# EAGLE design squawkbox_m_0.1 (EAGLE 7.6.0)
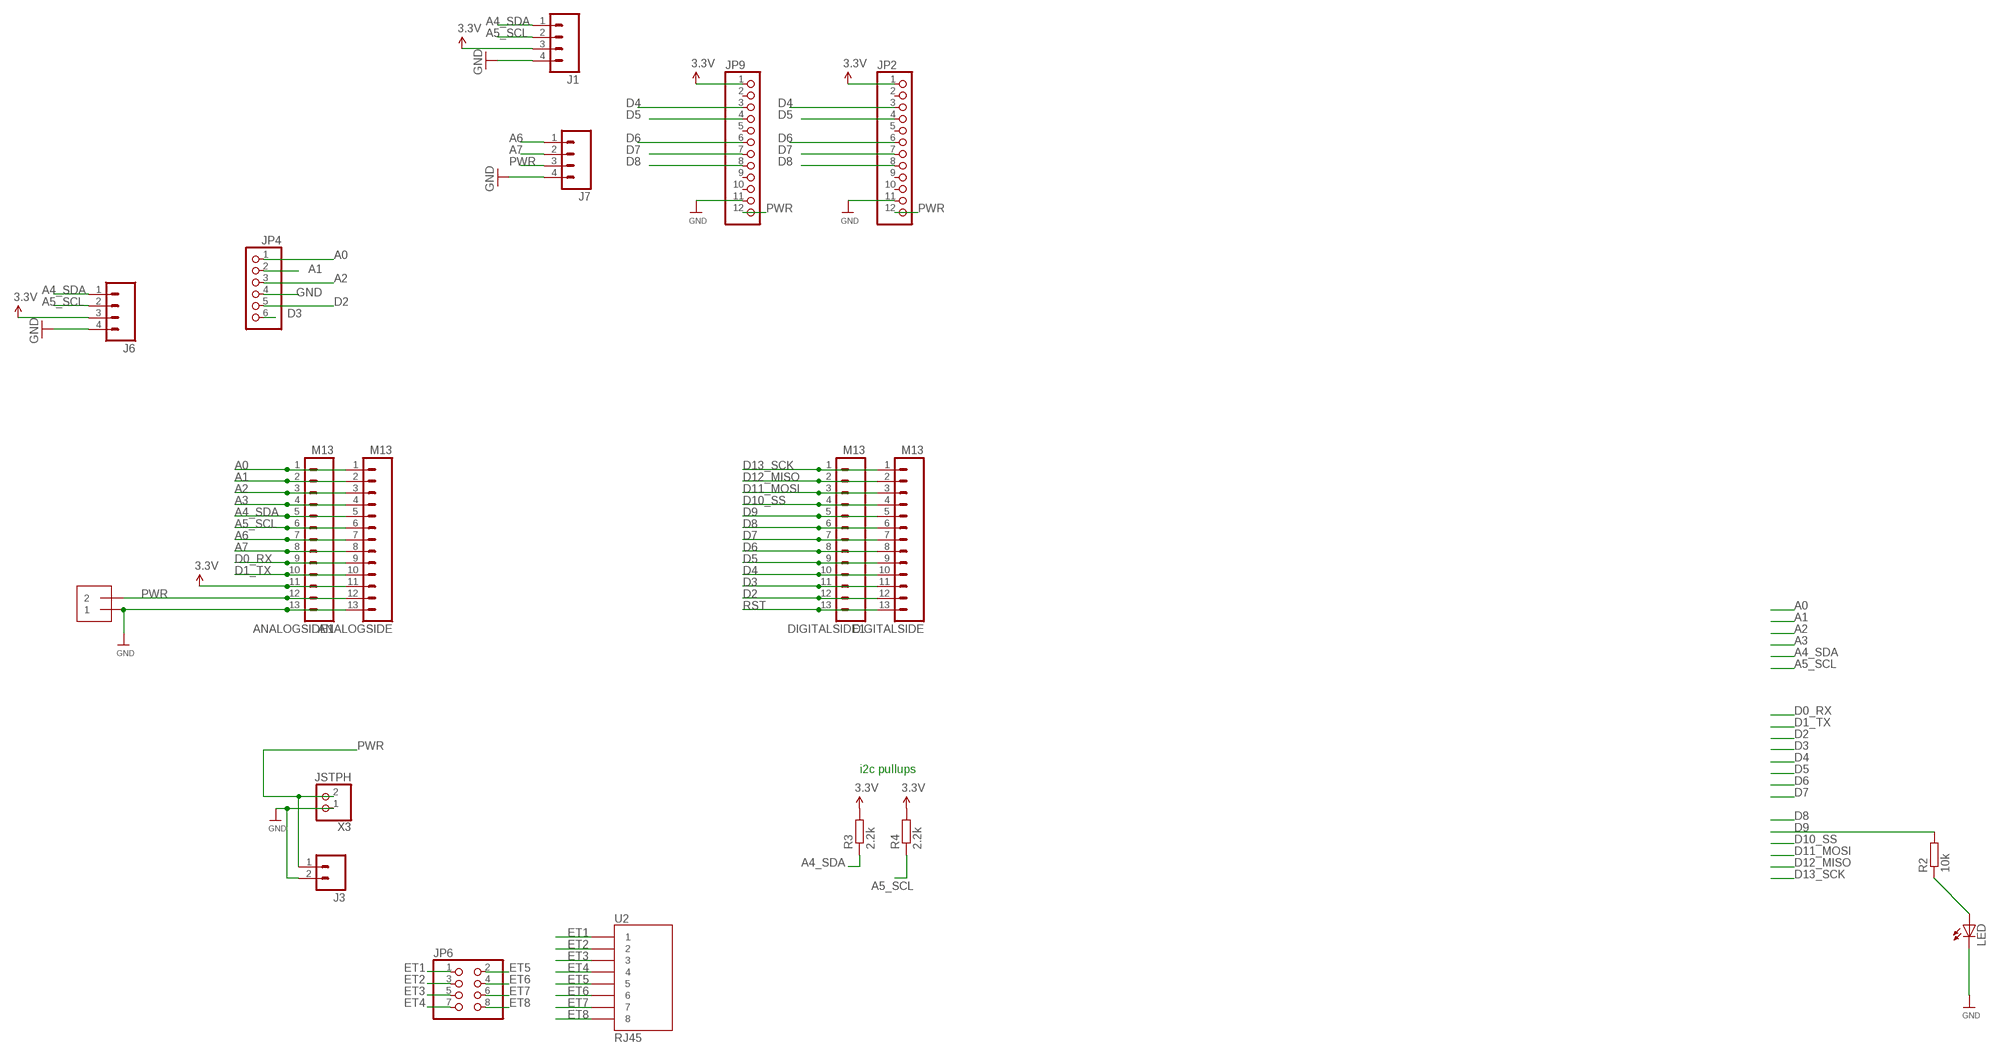
[diagram p0: schematic, sheet 1]

## Parts
ANALOGSIDE  M13  [1X13]
ANALOGSIDE1  M13  [1X13]
DIGITALSIDE  M13  [1X13]
DIGITALSIDE1  M13  [1X13]
J1  M04PTH  [1X04]
J2  1X2-3.5MM  [1X2-3.5MM]
J3  M02PTH  [1X02]
J6  M04SCREW  [SCREWTERMINAL-3.5MM-4]
J7  M04SCREW  [SCREWTERMINAL-3.5MM-4]
JP2  PINHD-1X12-CB  [1X12-CB]
JP4  PINHD-1X6-3.5MM  [1X06-3.5MM]
JP6  PINHD-2X4  [2X04]
JP9  PINHD-1X12-CB  [1X12-CB]
LED  LED3MM  [LED3MM]
R2  10k  R-EU_0204/7  [0204/7]
R3  2.2k  R-EU_0204/7  [0204/7]
R4  2.2k  R-EU_0204/7  [0204/7]
U2  RJ45  RJ45-8PTH  [RJ45-8]
X3  JSTPH  CON_JST_PH_2PIN  [JSTPH2]

## Nets
A0: ANALOGSIDE1.1 ANALOGSIDE.1 JP4.1
A1: ANALOGSIDE1.2 ANALOGSIDE.2 JP4.2
A2: ANALOGSIDE1.3 ANALOGSIDE.3 JP4.3
A3: ANALOGSIDE1.4 ANALOGSIDE.4
A4_SDA: ANALOGSIDE1.5 ANALOGSIDE.5 J1.1 J6.1 R3.1
A5_SCL: ANALOGSIDE1.6 ANALOGSIDE.6 J1.2 J6.2 R4.1
A6: ANALOGSIDE1.7 ANALOGSIDE.7 J7.1
A7: ANALOGSIDE1.8 ANALOGSIDE.8 J7.2
D0_RX: ANALOGSIDE1.9 ANALOGSIDE.9
D1_TX: ANALOGSIDE1.10 ANALOGSIDE.10
D2: DIGITALSIDE1.12 DIGITALSIDE.12 JP4.5
D3: DIGITALSIDE1.11 DIGITALSIDE.11 JP4.6
D4: DIGITALSIDE1.10 DIGITALSIDE.10 JP2.3 JP9.3
D5: DIGITALSIDE1.9 DIGITALSIDE.9 JP2.4 JP9.4
D6: DIGITALSIDE1.8 DIGITALSIDE.8 JP2.6 JP9.6
D7: DIGITALSIDE1.7 DIGITALSIDE.7 JP2.7 JP9.7
D8: DIGITALSIDE1.6 DIGITALSIDE.6 JP2.8 JP9.8
D9: DIGITALSIDE1.5 DIGITALSIDE.5 R2.2
D10_SS: DIGITALSIDE1.4 DIGITALSIDE.4
D11_MOSI: DIGITALSIDE1.3 DIGITALSIDE.3
D12_MISO: DIGITALSIDE1.2 DIGITALSIDE.2
D13_SCK: DIGITALSIDE1.1 DIGITALSIDE.1
ET1: JP6.1 U2.1
ET2: JP6.3 U2.2
ET3: JP6.5 U2.3
ET4: JP6.7 U2.4
ET5: JP6.2 U2.5
ET6: JP6.4 U2.6
ET7: JP6.6 U2.7
ET8: JP6.8 U2.8
GND [power]: ANALOGSIDE1.13 ANALOGSIDE.13 J1.4 J2.1 J3.2 J6.4 J7.4 JP2.11 JP4.4 JP9.11 LED.K(C) X3.1
N$2: LED.A R2.1
PWR [power]: ANALOGSIDE1.12 ANALOGSIDE.12 J2.2 J3.1 J7.3 JP2.12 JP9.12 X3.2
RST: DIGITALSIDE1.13 DIGITALSIDE.13
SPEAKER2+: JP2.10
SPEAKER2+1: JP9.10
VCC [power]: ANALOGSIDE1.11 ANALOGSIDE.11 J1.3 J6.3 JP2.1 JP9.1 R3.2 R4.2 ; supply symbol labelled 3.3V
Unconnected: JP2.2 JP2.5 JP2.9 JP9.2 JP9.5 JP9.9

## Notes on the sheet
- i2c pullups

## Library data of the parts
ANALOGSIDE ANALOGSIDE1 DIGITALSIDE DIGITALSIDE1 = SparkFun-Connectors:M13: 13-pin single row .1" header
J1 = SparkFun-Connectors:M04: Header 4 Standard 4-pin 0.1" header. Use with straight break away headers (SKU : PRT-00116), right angle break away headers (PRT-00553), swiss pins (PRT-00743), machine pins (PRT-00117), and female headers (PRT-00115). Molex polarized connector foot print use with SKU : PRT-08231 with associated crimp pins and housings. 1MM SMD Version SKU: PRT-10208; PROD_ID: CONN-09696
J2 = adafruit:1X2: 3.5mm Terminal block http://www.ladyada.net/library/pcb/eaglelibrary.html
J3 = SparkFun-Connectors:M02: Standard 2-pin 0.1" header. Use with - straight break away headers ( PRT-00116) - right angle break away headers (PRT-00553) - swiss pins (PRT-00743) - machine pins (PRT-00117) - female headers (PRT-00115) Molex polarized connector foot print use with: PRT-08233 with associated crimp pins and housings. 2.54_SCREWTERM for use with PRT-10571. 3.5mm Screw Terminal footprints for PRT-08084 5mm Screw Terminal footprints for use with PRT-08432
J6 J7 = SparkFun-Connectors:M04: Header 4 Standard 4-pin 0.1" header. Use with straight break away headers (SKU : PRT-00116), right angle break away headers (PRT-00553), swiss pins (PRT-00743), machine pins (PRT-00117), and female headers (PRT-00115). Molex polarized connector foot print use with SKU : PRT-08231 with associated crimp pins and housings. 1MM SMD Version SKU: PRT-10208; PROD_ID: Combine 2x8399
JP2 JP9 = adafruit2:PINHD-1X12: PIN HEADER
JP4 = adafruit:PINHD-1X6: PIN HEADER
JP6 = pinhead:PINHD-2X4: PIN HEADER
LED = led:LED: LED OSRAM: - CHIPLED LG R971, LG N971, LY N971, LG Q971, LY Q971, LO R971, LY R971 LH N974, LH R974 LS Q976, LO Q976, LY Q976 LO Q996 - Hyper CHIPLED LW Q18S LB Q993, LB Q99A, LB R99A - SideLED LS A670, LO A670, LY A670, LG A670, LP A670 LB A673, LV A673, LT A673, LW A673 LH A674 LY A675 LS A676, LA A676, LO A676, LY A676, LW A676 LS A679, LY A679, LG A679 - Hyper Micro SIDELED® LS Y876, LA Y876, LO Y876, LY Y876 LT Y87S - SmartLED LW L88C, LW L88S LB L89C, LB L89S, LG L890 LS L89K, LO L89K, LY L89K LS L896, LA L896, LO L896, LY L896 - TOPLED LS T670, LO T670, LY T670, LG T670, LP T670 LSG T670, LSP T670, LSY T670, LOP T670, LYG T670 LG T671, LOG T671, LSG T671 LB T673, LV T673, LT T673, LW T673 LH T674 LS T676, LA T676, LO T676, LY T676, LB T676, LH T676, LSB T676, LW T676 LB T67C, LV T67C, LT T67C, LS T67K, LO T67K, LY T67K, LW E67C LS E67B, LA E67B, LO E67B, LY E67B, LB E67C, LV E67C, LT E67C LW T67C LS T679, LY T679, LG T679 LS T770, LO T770, LY T770, LG T770, LP T770 LB T773, LV T773, LT T773, LW T773 LH T774 LS E675, LA E675, LY E675, LS T675 LS T776, LA T776, LO T776, LY T776, LB T776 LHGB T686 LT T68C, LB T68C - Hyper Mini TOPLED® LB M676 - Mini TOPLED Santana® LG M470 LS M47K, LO M47K, LY M47K Source: http://www.osram.convergy.de LUXEON: - LUMILED® LXK2-PW12-R00, LXK2-PW12-S00, LXK2-PW14-U00, LXK2-PW14-V00 LXK2-PM12-R00, LXK2-PM12-S00, LXK2-PM14-U00 LXK2-PE12-Q00, LXK2-PE12-R00, LXK2-PE12-S00, LXK2-PE14-T00, LXK2-PE14-U00 LXK2-PB12-K00, LXK2-PB12-L00, LXK2-PB12-M00, LXK2-PB14-N00, LXK2-PB14-P00, LXK2-PB14-Q00 LXK2-PR12-L00, LXK2-PR12-M00, LXK2-PR14-Q00, LXK2-PR14-R00 LXK2-PD12-Q00, LXK2-PD12-R00, LXK2-PD12-S00 LXK2-PH12-R00, LXK2-PH12-S00 LXK2-PL12-P00, LXK2-PL12-Q00, LXK2-PL12-R00 Source: www.luxeon.com KINGBRIGHT: KA-3528ASYC Source: www.kingbright.com
R2-R4 = resistor:R-EU_: RESISTOR, European symbol
U2 = SparkFun:RJ45-8: RJ45 Jack Simple RJ45, 8-pin connection - connector for common Cat5, Cat5e, and Cat6 Ethernet cables. Footprint not yet proven in production. Connector sku is PRT-00643; Breakout PCB sku is BOB-00716.
X3 = microbuilder:CON_JST_PH_2PIN: JST 2-Pin Right-Angle Connector PH-Series - 4UConnector: 17311 SH-Series - 4UConnector: 07278

## Net classes
1 power: width 0.381 mm, clearance 0.254 mm

## Board
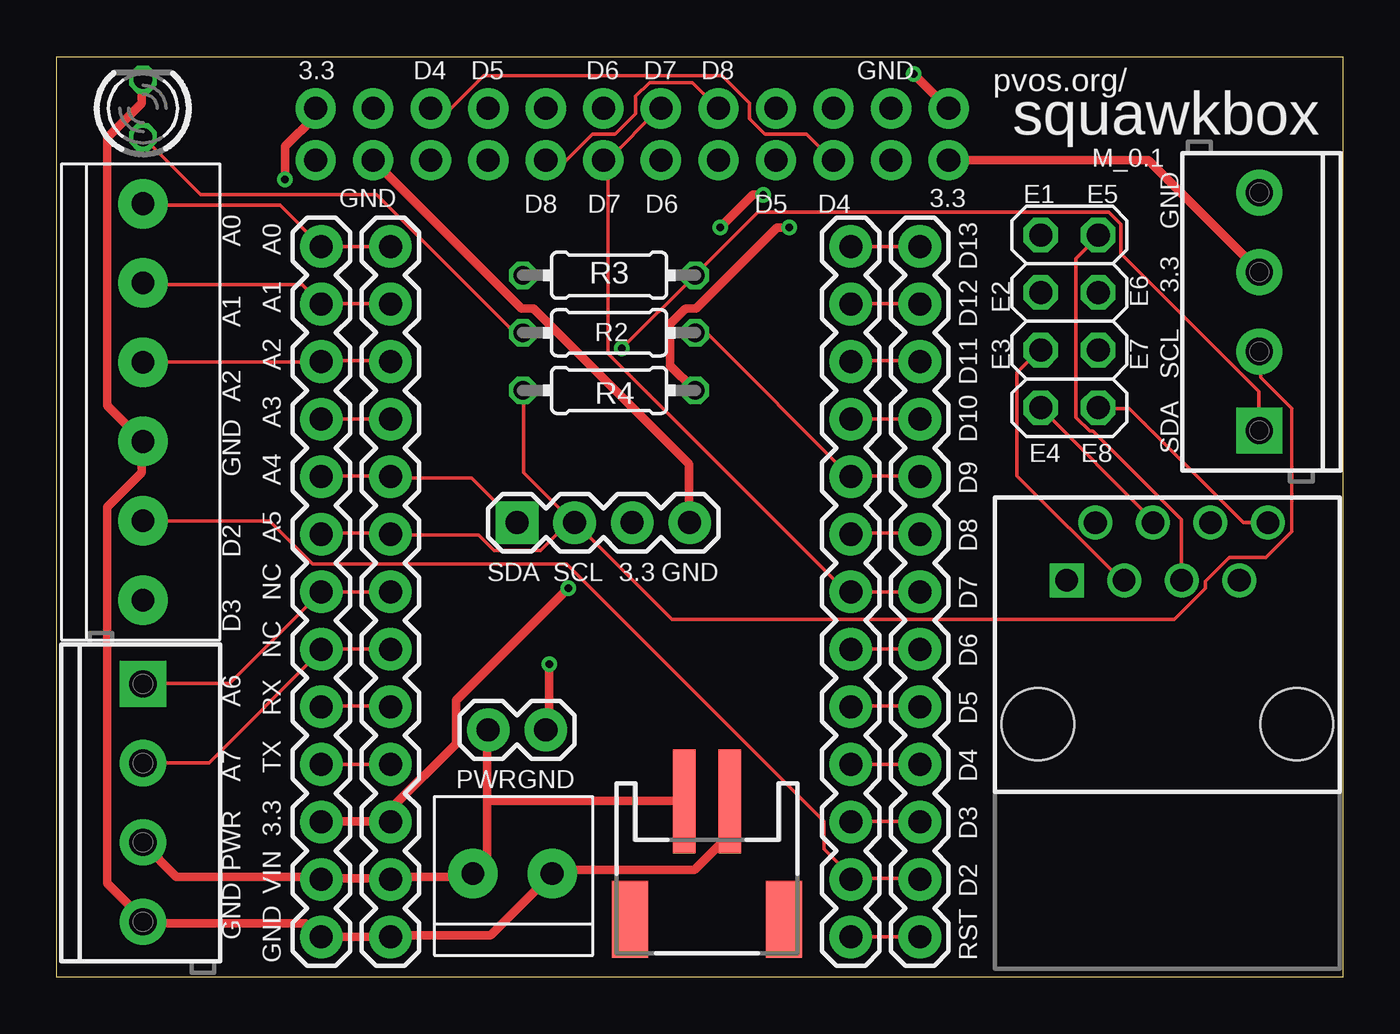
[diagram p1: board, top side]
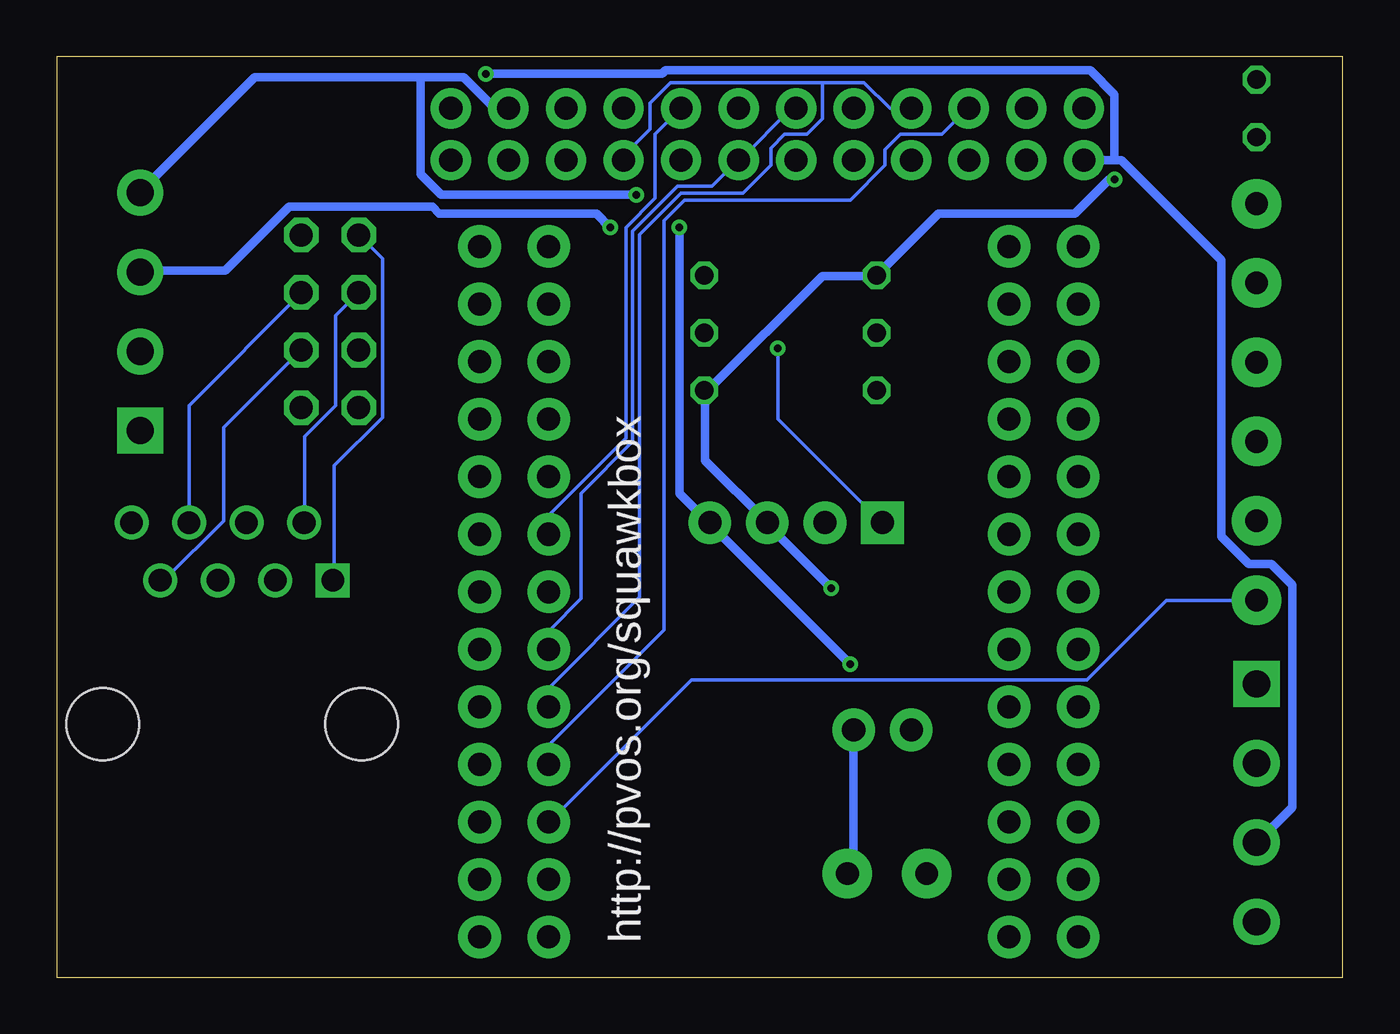
[diagram p2: board, bottom side, seen from below]

Size 56.77 x 40.64 mm. Coordinates in mm from the lower left corner, seen from the top.
Outline: 0,40.64 56.77,40.64 56.77,0 0,0 0,40.64
Copper layers (1*16): Top 0.0356mm / dielectric 1.5011mm / Bottom 0.0356mm
Design rules "oshpark-2layer": minimum track width 6mil, minimum drill 13mil, track to track 6mil, track to pad 6mil, pad to pad 6mil, via to via 6mil, smd to smd 6mil, copper to edge 15mil, drill to drill 6mil, minimum pad ring 7mil, minimum via ring 7mil, stop-mask expansion 2.5mil, vias tented up to drill 0mil, thermal gap 10mil

### Footprints (pad centres in the part's own frame; a part is rotated, then mirrored left to right if it is on the bottom)
1X13 = drill 1.016 pad 1.88: 1 0,0; 2 2.54,0; 3 5.08,0; 4 7.62,0; 5 10.16,0; 6 12.7,0; 7 15.24,0; 8 17.78,0; 9 20.32,0; 10 22.86,0; 11 25.4,0; 12 27.94,0; 13 30.48,0
1X04 = drill 1.016 pad 1.88 square: 1 0,0 | drill 1.016 pad 1.88: 2 2.54,0; 3 5.08,0; 4 7.62,0
1X2-3.5MM = drill 1 pad 2.184: 1 1.8,0; 2 -1.7,0
1X02 = drill 1.016 pad 1.88: 1 0,0; 2 2.54,0
SCREWTERMINAL-3.5MM-4 = drill 1.2 pad 2.032 square: 1 0,0 | drill 1.2 pad 2.032: 2 3.5,0; 3 7,0; 4 10.5,0
1X12-CB = drill 1.016 pad 1.778: 1 -13.97,0; 2 -11.43,0; 3 -8.89,0; 4 -6.35,0; 5 -3.81,0; 6 -1.27,0; 7 1.27,0; 8 3.81,0; 9 6.35,0; 10 8.89,0; 11 11.43,0; 12 13.97,0
1X06-3.5MM = drill 1 pad 2.184: 1 -8.75,0; 2 -5.25,0; 3 -1.75,0; 4 1.75,0; 5 5.25,0; 6 8.75,0
2X04 = drill 1.016 octagon: 1 -3.81,-1.27; 2 -3.81,1.27; 3 -1.27,-1.27; 4 -1.27,1.27; 5 1.27,-1.27; 6 1.27,1.27; 7 3.81,-1.27; 8 3.81,1.27
LED3MM = drill 0.813 octagon: A -1.27,0; K 1.27,0
0204/7 = drill 0.813 octagon: 1 -3.81,0; 2 3.81,0
RJ45-8 = drill 1 square: 1 -4.445,6.35 | drill 1: 2 -3.175,8.89; 3 -1.905,6.35; 4 -0.635,8.89; 5 0.635,6.35; 6 1.905,8.89; 7 3.175,6.35; 8 4.445,8.89 | hole 3.2: -5.715,0; 5.715,0
JSTPH2 = smd 1 x 4.6: 1 -1,-3.7; 2 1,-3.7 | smd 1.6 x 3.4: NC1 -3.4,1.5; NC2 3.4,1.5

### Placement (x,y rotation side)
ANALOGSIDE  14.73,32.26 270 top
ANALOGSIDE1  11.68,32.26 270 top
DIGITALSIDE  35.05,32.26 270 top
DIGITALSIDE1  38.1,32.26 270 top
J1  20.32,20.07 0 top
J2  20.07,4.57 0 top
J3  19.05,10.92 0 top
J6  53.09,24.13 90 top
J7  3.81,12.95 270 top
JP2  25.4,36.07 180 top
JP4  3.81,25.4 270 top
JP6  44.7,28.96 270 top
JP9  25.4,38.35 0 top
LED  3.81,38.35 90 top
R2  24.38,28.45 0 top
R3  24.38,30.99 180 top
R4  24.38,25.91 0 top
U2  49.02,11.18 0 top
X3  28.7,4.06 180 top

### Tracks (layer width: path | path; a pad name or v marks a point on that pad's centre or on a via)
A0
  Top 0.152: ANALOGSIDE.1 ANALOGSIDE1.1 9.86,34.09 3.83,34.09 JP4.1
A1
  Top 0.152: 11.68,29.74 14.73,29.74 ANALOGSIDE.2 | 11.68,29.74 10.85,30.58 3.83,30.58 JP4.2 | 11.68,29.74 ANALOGSIDE1.2
A2
  Top 0.152: ANALOGSIDE.3 14.73,27.23 11.68,27.23 ANALOGSIDE1.3 11.68,27.15 3.83,27.15 JP4.3
A3
  Top 0.152: ANALOGSIDE.4 ANALOGSIDE1.4
A4_SDA  (via drill 0.33)
  Top 0.152: ANALOGSIDE1.5 11.68,22.12 14.73,22.12 ANALOGSIDE.5 14.73,22.05 18.31,22.05 20.3,20.07 J1.1 | v24.94,27.76 28.14,30.96 R3.1 28.22,31.04 30.96,33.78 46.43,33.78 46.96,33.25 46.96,31.95 53.06,25.86 53.06,24.18 J6.1
  Bottom 0.152: v24.94,27.76 24.94,24.64 20.37,20.07 J1.1
A5_SCL
  Top 0.152: ANALOGSIDE1.6 11.68,19.61 14.73,19.61 ANALOGSIDE.6 14.73,19.53 18.62,19.53 19.3,18.85 21.36,18.85 22.66,20.14 J1.2 | R4.1 20.6,25.86 20.6,22.28 22.81,20.07 J1.2 | J6.2 53.14,27.61 53.14,26.47 54.51,25.1 54.51,19.69 53.36,18.54 51.77,18.54 50.7,17.48 50.7,17.17 49.33,15.8 27.15,15.8 22.89,20.07 J1.2
A6
  Top 0.152: ANALOGSIDE.7 ANALOGSIDE1.7 7.65,12.98 3.83,12.98 J7.1
A7
  Top 0.152: ANALOGSIDE.8 14.73,14.5 11.68,14.5 ANALOGSIDE1.8 11.68,14.43 6.73,9.47 3.83,9.47 J7.2
D0_RX
  Top 0.152: ANALOGSIDE1.9 11.68,11.99 14.73,11.99 ANALOGSIDE.9
D1_TX
  Top 0.152: ANALOGSIDE.10 ANALOGSIDE1.10
D2
  Top 0.152: DIGITALSIDE1.12 38.05,4.37 35.08,4.37 DIGITALSIDE.12 35.08,4.45 33.86,5.66 33.86,6.88 22.5,18.24 11.3,18.24 9.4,20.14 3.83,20.14 JP4.5
D3
  Top 0.152: DIGITALSIDE.11 35.08,6.88 38.05,6.88 DIGITALSIDE1.11
  Bottom 0.152: JP4.6 3.83,16.64 7.8,16.64 11.3,13.13 28.75,13.13 35,6.88 DIGITALSIDE.11
D4
  Top 0.152: DIGITALSIDE1.10 DIGITALSIDE.10 | JP9.3 17.4,38.35 18.85,39.8 29.36,39.8 30.58,38.58 30.58,37.9 31.27,37.21 33.1,37.21 34.24,36.07 JP2.3
  Bottom 0.152: DIGITALSIDE.10 35,9.4 35,10.31 29.97,15.34 29.97,33.4 29.06,34.31 21.74,34.31 20.22,35.84 20.22,36.52 19.53,37.21 17.7,37.21 16.56,38.35 JP9.3
D5
  Top 0.152: DIGITALSIDE.9 35.08,11.99 38.05,11.99 DIGITALSIDE1.9
  Bottom 0.152: JP9.4 19.99,38.35 21.13,39.5 22.96,39.5 | 22.96,39.5 29.67,39.5 30.58,38.58 30.58,37.44 31.72,36.3 31.72,36.07 JP2.4 | 22.96,39.5 22.96,37.9 23.65,37.21 24.64,37.21 25.25,36.6 25.25,35.84 26.47,34.62 29.21,34.62 31.04,32.79 31.04,16.79 35,12.83 35,11.99 DIGITALSIDE.9
D6
  Top 0.152: DIGITALSIDE.8 35.08,14.5 38.05,14.5 DIGITALSIDE1.8
  Bottom 0.152: JP9.6 24.33,38.35 26.62,36.07 JP2.6 26.7,36.07 27.84,34.92 29.36,34.92 31.34,32.94 31.34,23.65 33.63,21.36 33.63,16.71 35,15.34 35,14.5 DIGITALSIDE.8
D7
  Top 0.152: DIGITALSIDE1.7 DIGITALSIDE.7 34.85,17.02 24.33,27.53 24.33,36.07 | 24.33,36.07 JP2.7 24.18,36.07 | 24.33,36.07 26.62,38.35 JP9.7
D8
  Top 0.152: DIGITALSIDE.6 35.08,19.61 38.05,19.61 DIGITALSIDE1.6 | JP2.8 22.5,36.07 23.65,37.21 24.64,37.21 25.55,38.12 25.55,38.89 26.16,39.5 28.07,39.5 JP9.8
  Bottom 0.152: JP9.8 30.35,37.21 30.35,34.39 31.65,33.1 31.65,23.8 35,20.45 35,19.61 DIGITALSIDE.6
D9
  Top 0.152: R2.2 28.68,28.45 35,22.12 DIGITALSIDE.5 35.08,22.12 38.05,22.12 DIGITALSIDE1.5
D10_SS
  Top 0.152: DIGITALSIDE1.4 DIGITALSIDE.4
D11_MOSI
  Top 0.152: DIGITALSIDE.3 35.08,27.23 38.05,27.23 DIGITALSIDE1.3
D12_MISO
  Top 0.152: DIGITALSIDE.2 35.08,29.74 38.05,29.74 DIGITALSIDE1.2
D13_SCK
  Top 0.152: DIGITALSIDE1.1 DIGITALSIDE.1
ET1
  Bottom 0.152: JP6.1 42.39,31.72 42.39,24.71 44.53,22.58 44.53,17.55 U2.1
ET2
  Bottom 0.152: JP6.3 44.45,29.21 44.45,25.25 45.82,23.88 45.82,20.07 U2.2
ET3
  Top 0.152: U2.3 47.12,17.55 46.96,17.55 42.39,22.12 42.39,26.7 43.38,27.69 JP6.5
ET4
  Top 0.152: U2.4 48.34,20.07 48.34,20.22 43.46,25.1 JP6.7
ET5
  Top 0.152: U2.5 49.63,17.55 49.63,20.22 45.74,24.11 45.59,24.11 44.98,24.71 44.98,31.72 45.97,32.71 JP6.2
ET6
  Bottom 0.152: U2.6 50.93,25.25 45.97,30.2 JP6.4
ET7
  Bottom 0.152: JP6.6 49.4,24.26 49.4,20.14 51.99,17.55 52.15,17.55 U2.7
ET8
  Top 0.152: U2.8 52.38,20.07 47.35,25.1 45.97,25.1 JP6.8
GND  (via drill 0.33)
  Top 0.381: JP2.11 20.52,29.52 21.06,29.52 27.91,22.66 27.91,20.07 J1.4 | v31.19,34.54 30.73,34.54 v29.29,33.1 | LED.K 3.76,39.57 3.76,38.58 2.23,37.06 2.23,25.25 3.76,23.72 JP4.4 3.76,23.5 3.76,22.28 2.23,20.75 2.23,4.14 3.76,2.62 J7.4 3.83,2.39 11,2.39 11.53,1.85 ANALOGSIDE1.13 ANALOGSIDE.13 14.88,1.85 19.15,1.85 21.74,4.45 J2.1 21.89,4.6 22.05,4.75 28.14,4.75 29.67,6.27 29.67,7.72 X3.1 | v21.74,13.82 21.74,11.07 J3.2
  Bottom 0.381: JP9.11 37.44,38.35 38.81,39.73 40.72,39.73 | 40.72,39.73 48.03,39.73 53.06,34.7 J6.4 | 40.72,39.73 40.72,35.46 39.8,34.54 v31.19,34.54 | v29.29,33.1 29.29,21.36 27.99,20.07 J1.4 27.84,19.91 v21.74,13.82 | J3.2 21.59,4.83 21.82,4.6 J2.1
N$2
  Top 0.152: R2.1 20.22,28.45 14.12,34.54 6.35,34.54 LED.A
PWR  (via drill 0.33)
  Top 0.381: 19,7.8 19,5.21 18.39,4.6 J2.2 18.24,4.45 14.88,4.45 ANALOGSIDE.12 14.73,4.37 11.68,4.37 ANALOGSIDE1.12 11.53,4.45 5.28,4.45 3.83,5.89 J7.3 | 19,7.8 19,10.92 J3.1 | 19,7.8 27.69,7.8 X3.2 | v37.82,39.88 39.34,38.35 JP9.12
  Bottom 0.381: 10.08,36.07 9.78,36.07 5.36,31.65 5.36,19.46 4.14,18.24 3.15,18.24 2.23,17.32 2.23,7.49 3.76,5.97 J7.3 | 10.08,36.07 JP2.12 | v37.82,39.88 30.05,39.88 29.9,40.03 11.15,40.03 10.08,38.96 10.08,36.07
RST
  Top 0.152: DIGITALSIDE1.13 DIGITALSIDE.13
VCC  (via drill 0.33)
  Top 0.381: JP2.1 48.18,36.07 53.06,31.19 J6.3 | ANALOGSIDE1.11 11.68,6.88 14.73,6.88 ANALOGSIDE.11 14.81,7.04 14.81,7.49 17.63,10.31 17.63,12.22 v22.58,17.17 | v10.08,35.23 10.08,36.68 11.38,37.97 11.38,38.35 JP9.1 | v32.33,33.1 31.8,33.1 28.22,29.52 27.76,29.52 27.08,28.83 27.08,27 28.14,25.93 R4.2
  Bottom 0.381: v10.08,35.23 10.31,35.23 11.84,33.71 17.86,33.71 R3.2 20.6,30.96 22.96,30.96 27.99,25.93 R4.2 28.14,25.86 28.14,22.81 J1.3 25.32,19.91 v22.58,17.17 | v32.33,33.1 32.94,33.71 39.88,33.71 40.18,34.01 46.51,34.01 49.33,31.19 53.06,31.19 J6.3

### Text on the board
tPlace: pvos.org/ | squawkbox | M_0.1
bPlace: http://pvos.org/squawkbox
tNames: 3.3 | D4 | D5 | D6 | D7 | D8 | GND | GND | D8 | D7 | D6 | D5 | D4 | 3.3 | E1 | E5 | GND | A0 | A0 | D13 | E2 | E6 | 3.3 | A1 | A1 | R2 | D12 | E3 | E7 | A2 | D11 | SCL | A2 | A3 | D10 | SDA | GND | E4 | E8 | A4 | D9 | A5 | D2 | SDA | SCL | 3.3 | GND | D8 | NC | D7 | D3 | NC | D6 | A6 | RX | D5 | TX | PWR | GND | A7 | D4 | 3.3 | D3 | PWR | VIN | D2 | GND | GND | RST